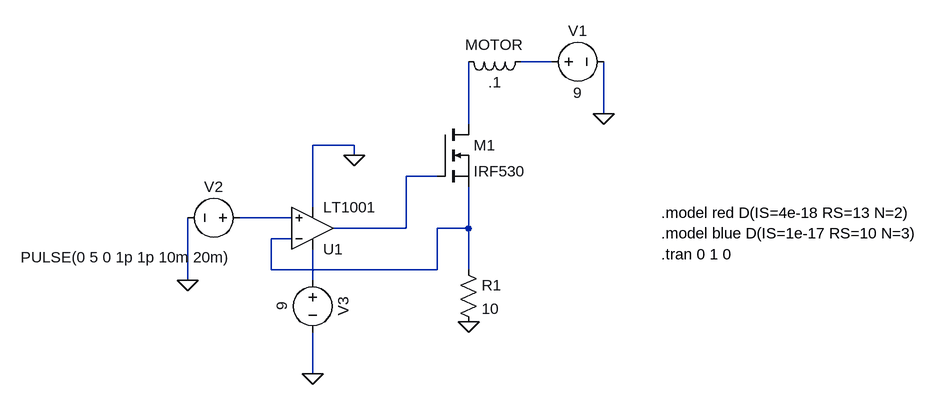
[diagram p0: schematic motor_simulation.asc]
motor_simulation.asc, the LTspice schematic file:
Version 4
SHEET 1 1220 916
WIRE 592 112 544 112
WIRE 672 192 672 112
WIRE 464 208 464 112
WIRE 288 240 224 240
WIRE 288 256 288 240
WIRE 416 288 368 288
WIRE 224 336 224 240
WIRE 192 352 112 352
WIRE 368 368 368 288
WIRE 368 368 256 368
WIRE 464 368 464 304
WIRE 464 368 416 368
WIRE 192 384 160 384
WIRE 160 432 160 384
WIRE 416 432 416 368
WIRE 416 432 160 432
WIRE 464 432 464 368
WIRE 32 448 32 352
WIRE 224 448 224 400
WIRE 224 592 224 528
FLAG 32 448 0
FLAG 224 592 0
FLAG 464 512 0
FLAG 288 256 0
FLAG 672 192 0
SYMBOL OpAmps\\LT1001 224 432 M180
SYMATTR InstName U1
SYMBOL voltage 128 352 R90
WINDOW 0 -32 56 VBottom 2
WINDOW 3 45 191 VTop 2
WINDOW 123 0 0 Left 0
WINDOW 39 0 0 Left 0
SYMATTR InstName V2
SYMATTR Value PULSE(0 5 0 1p 1p 10m 20m)
SYMBOL voltage 224 432 R0
WINDOW 0 32 56 VTop 2
WINDOW 3 -32 56 VBottom 2
WINDOW 123 0 0 Left 0
WINDOW 39 0 0 Left 0
SYMATTR InstName V3
SYMATTR Value 9
SYMBOL res 448 416 R0
SYMATTR InstName R1
SYMATTR Value 10
SYMBOL voltage 576 112 R270
WINDOW 0 32 56 VTop 2
WINDOW 3 -32 56 VBottom 2
WINDOW 123 0 0 Left 0
WINDOW 39 0 0 Left 0
SYMATTR InstName V1
SYMATTR Value 9
SYMBOL nmos 416 208 R0
SYMATTR InstName M1
SYMATTR Value IRF530
SYMBOL ind 560 96 R90
WINDOW 0 5 56 VBottom 2
WINDOW 3 32 56 VTop 2
SYMATTR InstName MOTOR
SYMATTR Value .1
TEXT 760 408 Left 2 !.tran 0 1 0
TEXT 760 344 Left 2 !.model red D(IS=4e-18 RS=13 N=2)
TEXT 760 376 Left 2 !.model blue D(IS=1e-17 RS=10 N=3)

The netlist it stands for:
* motor_simulation.asc
XU1 N004 N005 N006 0 N003 LT1001  ; pins In+ In- V+ V- OUT
V2 N004 0 PULSE(0 5 0 1p 1p 10m 20m)
V3 N006 0 9
R1 N005 0 10
V1 N001 0 9
M1 N002 N003 N005 N005 IRF530
L§MOTOR N001 N002 .1
.model NMOS NMOS
.model PMOS PMOS
.lib standard.mos
.tran 0 1 0
.model red D(IS=4e-18 RS=13 N=2)
.model blue D(IS=1e-17 RS=10 N=3)
.lib LTC.lib
.backanno
.end